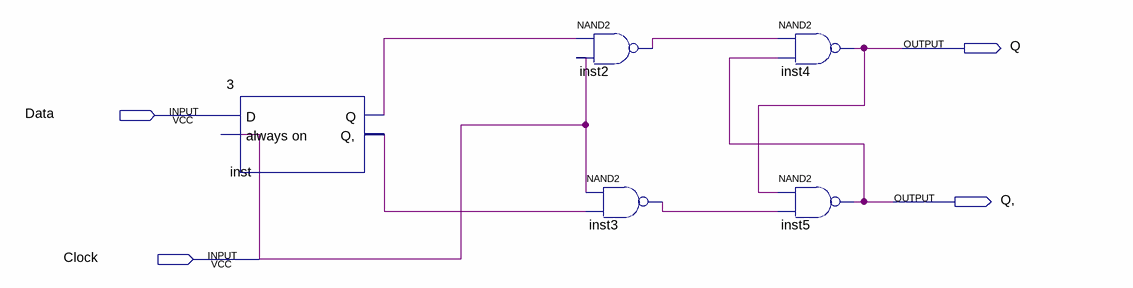
[diagram p0: schematic sheet]
// Quartus schematic 4.bdf as structural Verilog: 5 symbols, 4 pins
module \4  (
  input  Data,
  input  Clock,
  output Q
);

  wire inst2_out, inst3_out, inst5_out, inst_q, inst_q_;

  \3  inst (.D(Data), .\always_on (Clock), .Q(inst_q), .\Q, (inst_q_));
  nand inst2 (inst2_out, inst_q, Clock);
  nand inst3 (inst3_out, Clock, inst_q_);
  nand inst4 (Q, inst2_out, inst5_out);
  nand inst5 (inst5_out, Q, inst3_out);
endmodule
